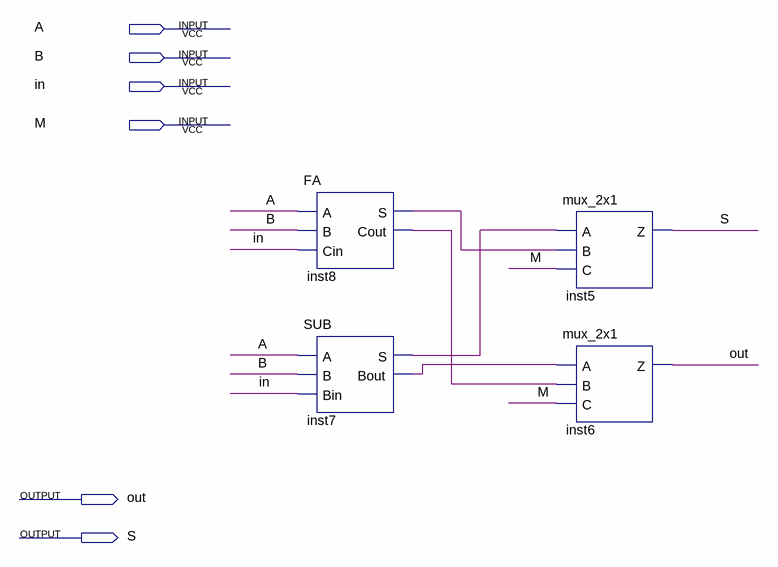
[diagram p0: schematic sheet]
// Quartus schematic HAS.bdf as structural Verilog: 4 symbols, 6 pins
module HAS (
  input  A,
  input  B,
  input  in,
  input  M,
  output out,
  output S
);

  wire inst7_bout, inst7_s, inst8_cout, inst8_s;

  FA inst8 (.A(A), .B(B), .Cin(in), .S(inst8_s), .Cout(inst8_cout));
  SUB inst7 (.A(A), .B(B), .Bin(in), .S(inst7_s), .Bout(inst7_bout));
  mux_2x1 inst5 (.A(inst7_s), .B(inst8_s), .C(M), .Z(S));
  mux_2x1 inst6 (.A(inst7_bout), .B(inst8_cout), .C(M), .Z(out));
endmodule
